# EAGLE schematic plen2_arduino (EAGLE 7.2.0)
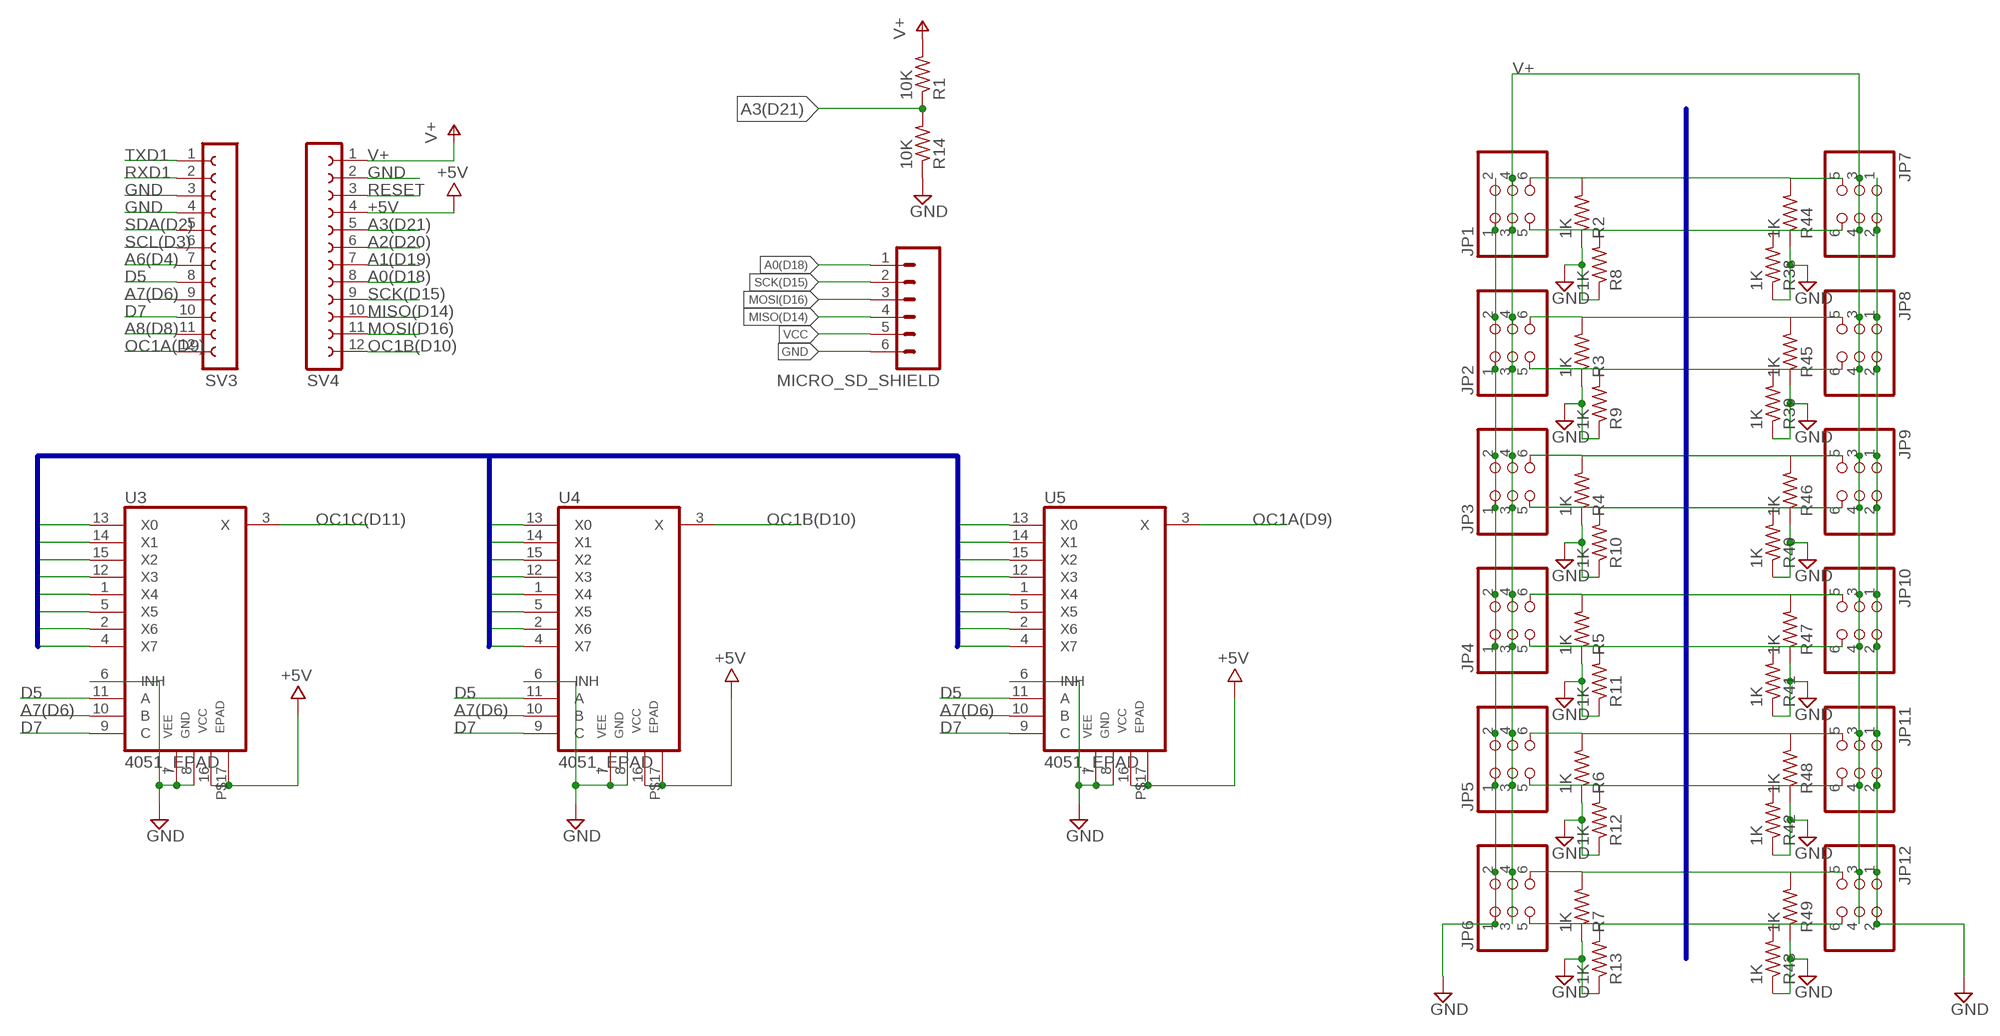
[diagram p0: schematic, sheet 1]

## Parts
JP1  PINHD-2X03_2.54  [2X03]
JP2  PINHD-2X03_2.54  [2X03]
JP3  PINHD-2X03_2.54  [2X03]
JP4  PINHD-2X03_2.54  [2X03]
JP5  PINHD-2X03_2.54  [2X03]
JP6  PINHD-2X03_2.54  [2X03]
JP7  PINHD-2X03_2.54  [2X03]
JP8  PINHD-2X03_2.54  [2X03]
JP9  PINHD-2X03_2.54  [2X03]
JP10  PINHD-2X03_2.54  [2X03]
JP11  PINHD-2X03_2.54  [2X03]
JP12  PINHD-2X03_2.54  [2X03]
MICRO_SD_SHIELD  M06SIP  [1X06]
R1  10K  R-US_R0402SMALL  [R0402S]
R2  1K  R-US_R0402SMALL  [R0402S]
R3  1K  R-US_R0402SMALL  [R0402S]
R4  1K  R-US_R0402SMALL  [R0402S]
R5  1K  R-US_R0402SMALL  [R0402S]
R6  1K  R-US_R0402SMALL  [R0402S]
R7  1K  R-US_R0402SMALL  [R0402S]
R8  1K  R-US_R0402SMALL  [R0402S]
R9  1K  R-US_R0402SMALL  [R0402S]
R10  1K  R-US_R0402SMALL  [R0402S]
R11  1K  R-US_R0402SMALL  [R0402S]
R12  1K  R-US_R0402SMALL  [R0402S]
R13  1K  R-US_R0402SMALL  [R0402S]
R14  10K  R-US_R0402SMALL  [R0402S]
R38  1K  R-US_R0402SMALL  [R0402S]
R39  1K  R-US_R0402SMALL  [R0402S]
R40  1K  R-US_R0402SMALL  [R0402S]
R41  1K  R-US_R0402SMALL  [R0402S]
R42  1K  R-US_R0402SMALL  [R0402S]
R43  1K  R-US_R0402SMALL  [R0402S]
R44  1K  R-US_R0402SMALL  [R0402S]
R45  1K  R-US_R0402SMALL  [R0402S]
R46  1K  R-US_R0402SMALL  [R0402S]
R47  1K  R-US_R0402SMALL  [R0402S]
R48  1K  R-US_R0402SMALL  [R0402S]
R49  1K  R-US_R0402SMALL  [R0402S]
SV3  FE12-1  [FE12]
SV4  FE12-1  [FE12]
U3  4051_EPAD  [SOT763-1]
U4  4051_EPAD  [SOT763-1]
U5  4051_EPAD  [SOT763-1]

## Nets
+5V: SV4.4 U3.16(VCC) U3.P$17(EPAD) U4.16(VCC) U4.P$17(EPAD) U5.16(VCC) U5.P$17(EPAD)
A0: MICRO_SD_SHIELD.1
A0(D18): SV4.8
A1(D19): SV4.7
A2(D20): SV4.6
A3(D21): R1.1 R14.2 SV4.5
A6(D4): SV3.7
A7(D6): SV3.9 U3.10(B) U4.10(B) U5.10(B)
A8(D8): SV3.11
D5: SV3.8 U3.11(A) U4.11(A) U5.11(A)
D7: SV3.10 U3.9(C) U4.9(C) U5.9(C)
GND: JP1.1 JP1.2 JP2.1 JP2.2 JP3.1 JP3.2 JP4.1 JP4.2 JP5.1 JP5.2 JP6.1 JP6.2 JP7.1 JP7.2 JP8.1 JP8.2 JP9.1 JP9.2 JP10.1 JP10.2 JP11.1 JP11.2 JP12.1 JP12.2 MICRO_SD_SHIELD.6 R2.1 R3.1 R4.1 R5.1 R6.1 R7.1 R8.1 R9.1 R10.1 R11.1 R12.1 R13.1 R14.1 R38.1 R39.1 R40.1 R41.1 R42.1 R43.1 R44.1 R45.1 R46.1 R47.1 R48.1 R49.1 SV3.3 SV3.4 SV4.2 U3.6(INH) U3.7(VEE) U3.8(GND) U4.6(INH) U4.7(VEE) U4.8(GND) U5.6(INH) U5.7(VEE) U5.8(GND)
MISO(D14): MICRO_SD_SHIELD.4 SV4.10
MOSI(D16): MICRO_SD_SHIELD.3 SV4.11
N$1: JP1.5 JP7.6 R8.2 R38.2
N$5: JP1.6 JP7.5 R2.2 R44.2
N$6: JP3.5 JP9.6 R10.2 R40.2
N$8: JP2.5 JP8.6 R9.2 R39.2
N$9: JP2.6 JP8.5 R3.2 R45.2
N$10: JP3.6 JP9.5 R4.2 R46.2
N$11: JP4.5 JP10.6 R11.2 R41.2
N$12: JP4.6 JP10.5 R5.2 R47.2
N$13: JP5.5 JP11.6 R12.2 R42.2
N$14: JP5.6 R6.2
N$15: JP6.5 JP12.6 R13.2 R43.2
N$16: JP6.6 JP12.5 R7.2 R49.2
N$25: JP11.5 R48.2
OC1A(D9): SV3.12 U5.3(X)
OC1B(D10): SV4.12 U4.3(X)
OC1C(D11): U3.3(X)
RESET: SV4.3
RXD1: SV3.2
SCK(D15): MICRO_SD_SHIELD.2 SV4.9
SCL(D3): SV3.6
SDA(D2): SV3.5
SRV0: U3.13(X0)
SRV1: U3.14(X1)
SRV2: U3.15(X2)
SRV3: U3.12(X3)
SRV4: U3.1(X4)
SRV5: U3.5(X5)
SRV6: U3.2(X6)
SRV7: U3.4(X7)
SRV8: U4.13(X0)
SRV9: U4.14(X1)
SRV10: U4.15(X2)
SRV11: U4.12(X3)
SRV12: U4.1(X4)
SRV13: U4.5(X5)
SRV14: U4.2(X6)
SRV15: U4.4(X7)
SRV16: U5.13(X0)
SRV17: U5.14(X1)
SRV18: U5.15(X2)
SRV19: U5.12(X3)
SRV20: U5.1(X4)
SRV21: U5.5(X5)
SRV22: U5.2(X6)
SRV23: U5.4(X7)
TXD1: SV3.1
V+: JP1.3 JP1.4 JP2.3 JP2.4 JP3.3 JP3.4 JP4.3 JP4.4 JP5.3 JP5.4 JP6.3 JP6.4 JP7.3 JP7.4 JP8.3 JP8.4 JP9.3 JP9.4 JP10.3 JP10.4 JP11.3 JP11.4 JP12.3 JP12.4 R1.2 SV4.1
VCC: MICRO_SD_SHIELD.5

## Buses
SRV[0..23]

## Library data of the parts
JP1-JP12 = pinhead-2:PINHD-2X03: PIN HEADER
MICRO_SD_SHIELD = SparkFun:M06: Header 6 Standard 6-pin 0.1" header. Use with straight break away headers (SKU : PRT-00116), right angle break away headers (PRT-00553), swiss pins (PRT-00743), machine pins (PRT-00117), and female headers (PRT-00115). Molex polarized connector foot print use with SKU : PRT-08094 with associated crimp pins and housings. NOTES ON THE VARIANTS LOCK and LOCK_LONGPADS... This footprint was designed to help hold the alignment of a through-hole component (i.e. 6-pin header) while soldering it into place. You may notice that each hole has been shifted either up or down by 0.005 of an inch from it's more standard position (which is a perfectly straight line). This slight alteration caused the pins (the squares in the middle) to touch the edges of the holes. Because they are alternating, it causes a "brace" to hold the component in place. 0.005 has proven to be the perfect amount of "off-center" position when using our standard breakaway headers. Although looks a little odd when you look at the bare footprint, once you have a header in there, the alteration is very hard to notice. Also, if you push a header all the way into place, it is covered up entirely on the bottom side. This idea of altering the position of holes to aid alignment will be further integrated into the Sparkfun Library for other footprints. It can help hold any component with 3 or more connection pins.
R1-R14 R38-R49 = rcl:R-US_: RESISTOR, American symbol
SV3 SV4 = con-lsta:FE12-1: FEMALE HEADER; OC_FARNELL: unknown; OC_NEWARK: unknown
U3-U5 = 40xx:4051_EPAD